# Altium project 70cm_13cm_diplexer.PrjPcb
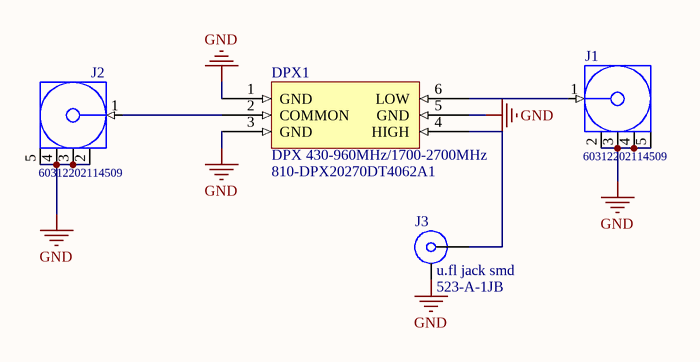
[diagram p0: 70cm_13cm_diplexer.SchDoc]
1 sheet, 4 parts. Net scope: global (net labels, ports and power ports of the same name join across sheets).
Board file: 70cm_13cm_diplexer.PcbDoc

## Sheet 70cm_13cm_diplexer.SchDoc
size A4

### Parts
DPX1  DPX 430-960MHz/1700-2700MHz  Supplier Part Number 1: 810-DPX20270DT4062A1  [1.6x0.8mm [EIA 0603]]
J1  60312202114509  [60312202114509]
J2  60312202114509  [60312202114509]
J3  u.fl jack smd  Supplier Part Number 1: 523-A-1JB  [U.FL jack]

### Nets
GND: DPX1.1(GND) DPX1.3(GND) DPX1.5(GND) J1.2(GND) J1.3(GND) J1.4(GND) J1.5(GND) J2.2(GND) J2.3(GND) J2.4(GND) J2.5(GND) J3.2
NetDPX1_2: DPX1.2(COMMON) J2.1(Signal)
NetDPX1_4: DPX1.4(HIGH) J3.1
NetDPX1_6: DPX1.6(LOW) J1.1(Signal)

### Library data of the parts
DPX1 = DPX202700DT-4062A1: Diplexer 430-960MHz/1700-2700MHz 0603; Manufacturer 1: TDK; Supplier 1: Mouser; Manufacturer: TDK; Manufacturer Part Number: DPX202700DT-4062A1; Stock 1: 2639; Mount: Surface Mount; Case Code (Metric): 2012; Case Code (Imperial): 0805; Packaging: Tape and Reel
J1 J2 = 60312202114509: WR-SMA SMA PCB End Launch Jack Round Post for 1.6 mm PCB; Impedance: 50 Ohm; Frequency Range: DC~18 GHz; Orientation Type: Straight; ComponentLink1Description: Manufacturer; ComponentLink1URL: http://www.we-online.de; ComponentLink2Description: Datasheet; ComponentLink2URL: https://katalog.we-online.de/em/datasheet/60312202114509.pdf; Part Number: 60312202114509; Published Date: August 2018; Publisher: Wurth Elektronik; Operating Temperature: -65 to 165 degC; Gender: Jack; Packaging: Tray; Connector Type: SMA; Mounting Technology: SMT
J3 = u.fl connector, jack A-1JB: Manufacturer 1: Amphenol / Amphenol RF; Manufacturer Part Number 1: A-1JB; Connector Type: AMC Coaxial; Body Style: Straight Jack; Coaxial Termination: Solder; Impedance: 50ohm; Frequency Max: 6GHz; Supplier 1: Mouser; Stock 1: 19506; Pricing 1: 1=0.65, 10=0.596, 50=0.535, 100=0.51, 1000=0.365, 10000=0.351 (USD); Contact Material: Brass; Contact Plating: Gold; ComponentLink1URL: https://datasheet.ciiva.com/22652/689597-22652949.pdf; ComponentLink1Description: https://datasheet.ciiva.com/22652/689597-22652949.pdf; ComponentLink2URL: https://datasheet.ciiva.com/15172/getdatasheetpartid-168895-15172647.pdf; ComponentLink2Description: https://datasheet.ciiva.com/15172/getdatasheetpartid-168895-15172647.pdf; ComponentLink3URL: https://datasheet.ciiva.com/36526/2036357-36526267.pdf; ComponentLink3Description: https://datasheet.ciiva.com/36526/2036357-36526267.pdf; ComponentLink4URL: https://datasheet.ciiva.com/5175/ca-1jb-38743-5175829.pdf; ComponentLink4Description: https://datasheet.ciiva.com/5175/ca-1jb-38743-5175829.pdf; ComponentLink5URL: https://datasheet.ciiva.com/3132/ca-1jb-3132240.pdf; ComponentLink5Description: https://datasheet.ciiva.com/3132/ca-1jb-3132240.pdf; ComponentLink6URL: https://datasheet.ciiva.com/14157/04614608-14157589.pdf; ComponentLink6Description: https://datasheet.ciiva.com/14157/04614608-14157589.pdf; ComponentLink7URL: https://datasheet.ciiva.com/643/ca-1jb-643532.pdf; ComponentLink7Description: https://datasheet.ciiva.com/643/ca-1jb-643532.pdf; ComponentLink8URL: https://datasheet.ciiva.com/14565/70142555-14565783.pdf; ComponentLink8Description: https://datasheet.ciiva.com/14565/70142555-14565783.pdf; ComponentLink9URL: https://datasheet.ciiva.com/643/ca-1jb-643531.pdf; ComponentLink9Description: https://datasheet.ciiva.com/643/ca-1jb-643531.pdf